# Altium project PCB_Project.PrjPcb
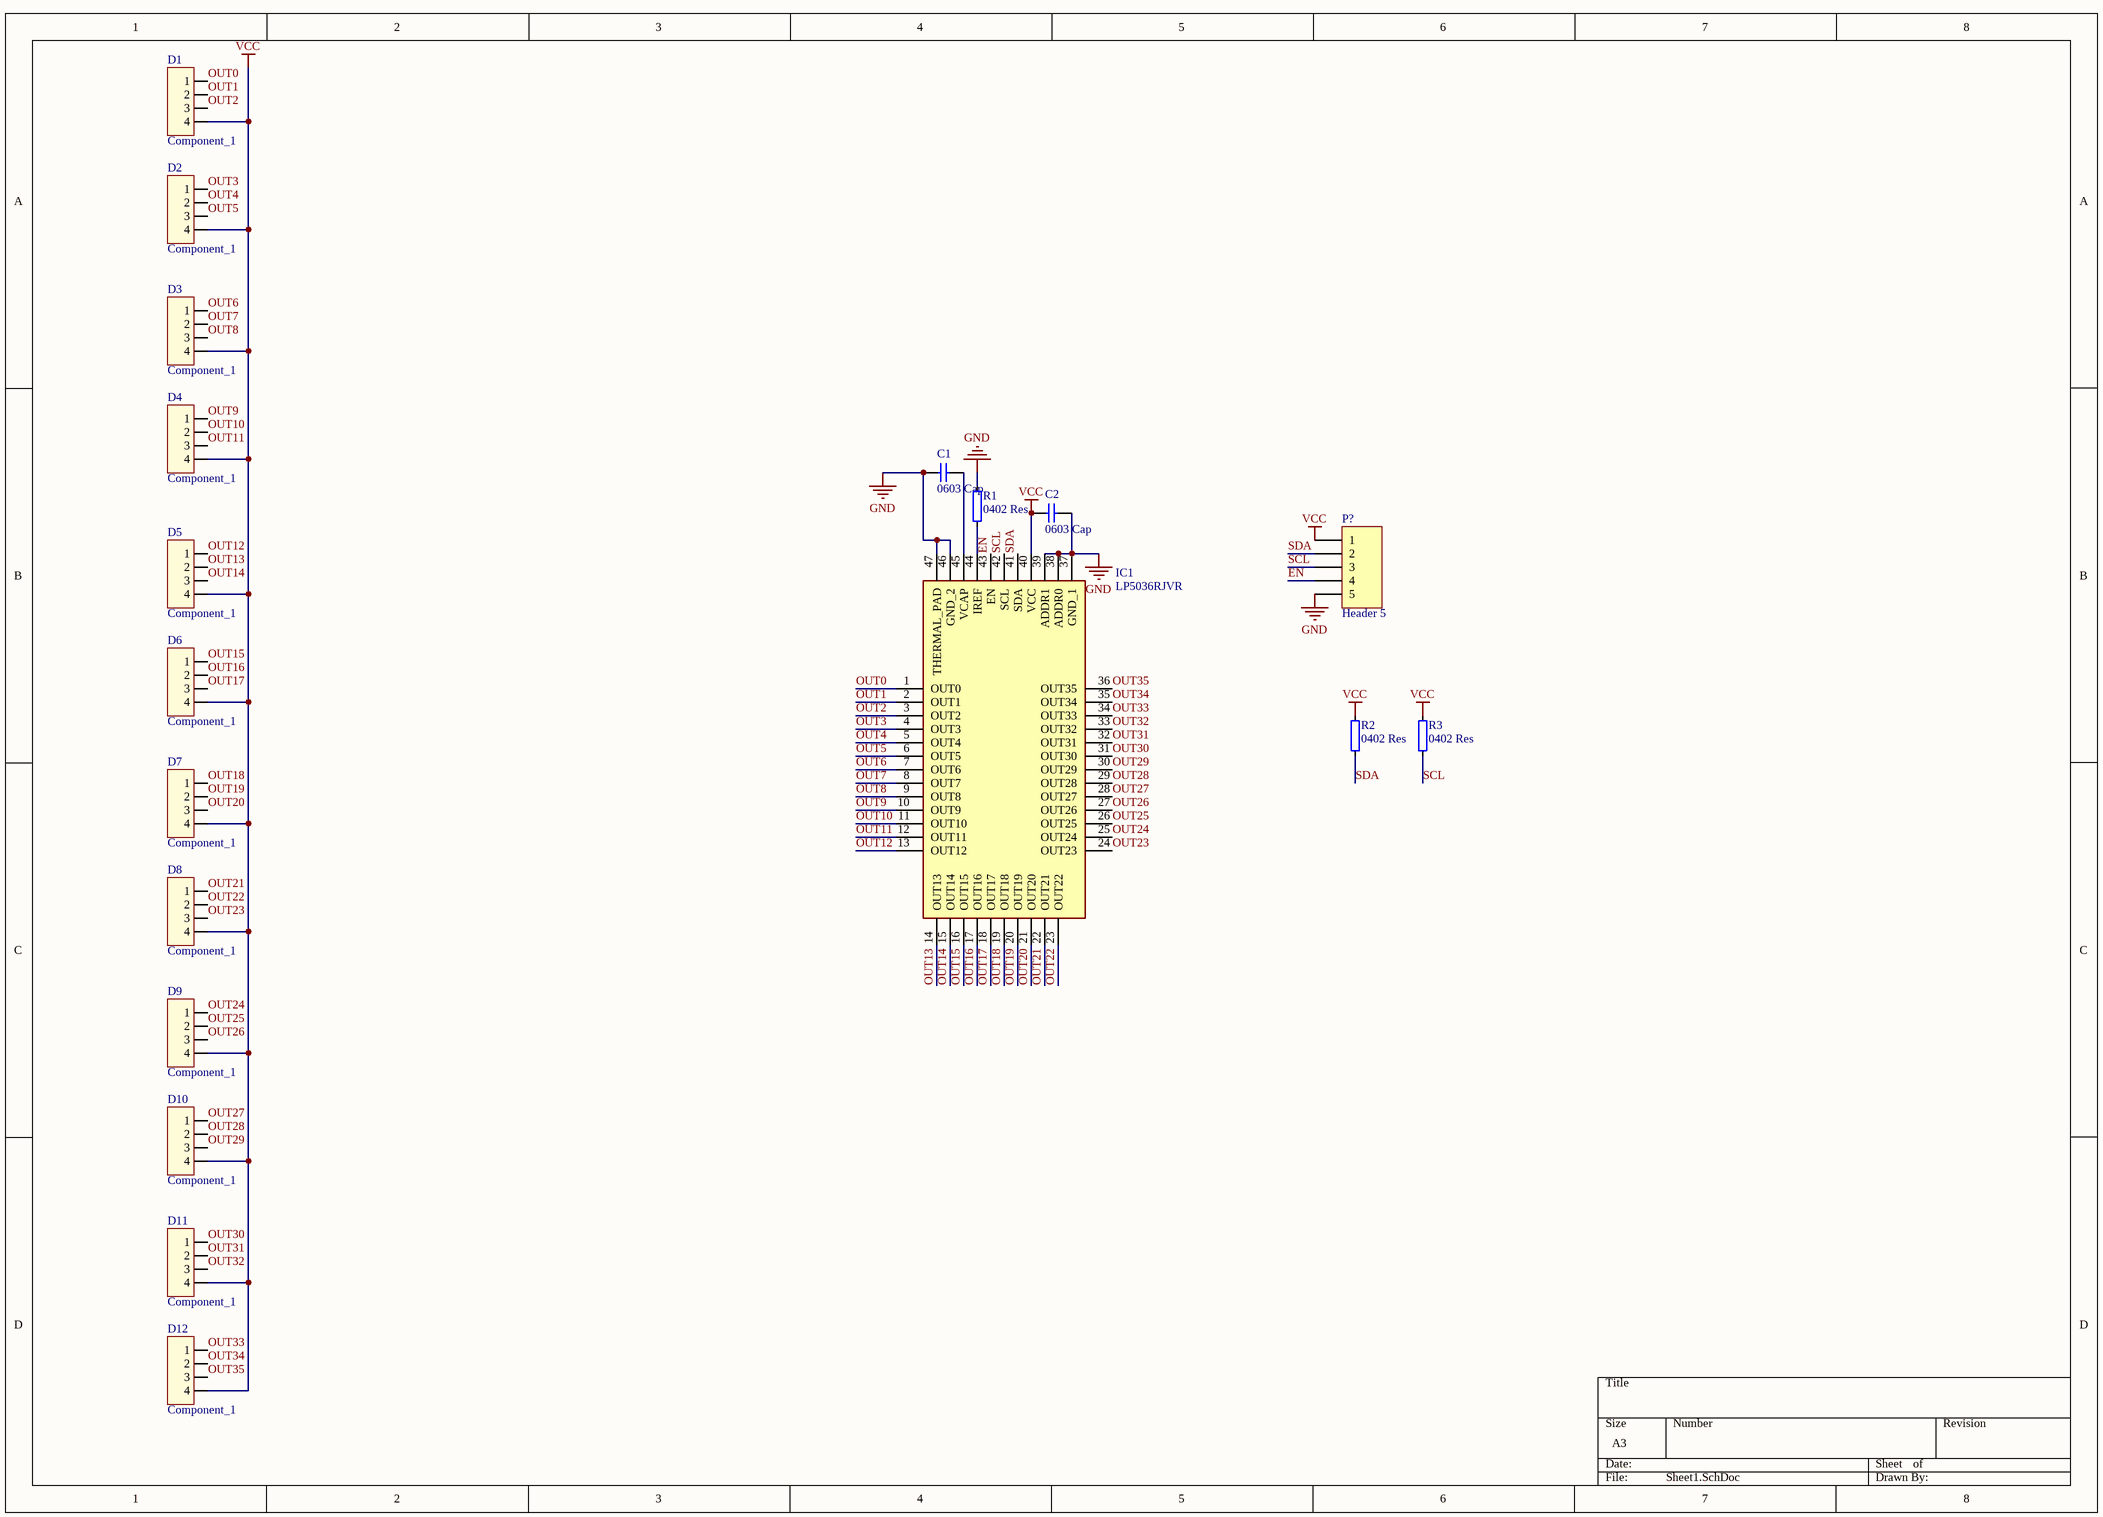
[diagram p0: Sheet1.SchDoc]
1 sheet, 19 parts. Net scope: global (net labels, ports and power ports of the same name join across sheets).
Board file: PCB2.PcbDoc

## Sheet Sheet1.SchDoc
size A3

### Parts
C1  0603 Cap  [0603 Cap]
C2  0603 Cap  [0603 Cap]
D1  Component_1  [PCBComponent_1]
D2  Component_1  [PCBComponent_1]
D3  Component_1  [PCBComponent_1]
D4  Component_1  [PCBComponent_1]
D5  Component_1  [PCBComponent_1]
D6  Component_1  [PCBComponent_1]
D7  Component_1  [PCBComponent_1]
D8  Component_1  [PCBComponent_1]
D9  Component_1  [PCBComponent_1]
D10  Component_1  [PCBComponent_1]
D11  Component_1  [PCBComponent_1]
D12  Component_1  [PCBComponent_1]
IC1  LP5036RJVR  [QFN40P500X600X100-47N-D]
P?  Header 5  [HDR1X5]
R1  0402 Res  [0402 Res]
R2  0402 Res  [0402 Res]
R3  0402 Res  [0402 Res]

### Nets
GND: C1.1 C2.2 IC1.37(GND_1) IC1.38(ADDR0) IC1.39(ADDR1) IC1.46(GND_2) IC1.47(THERMAL_PAD) P?.5 R1.2
VCC: C2.1 D1.4 D2.4 D3.4 D4.4 D5.4 D6.4 D7.4 D8.4 D9.4 D10.4 D11.4 D12.4 IC1.40(VCC) P?.1 R2.2 R3.2
EN: IC1.43(EN) P?.4
OUT0: D1.1 IC1.1(OUT0)
OUT1: D1.2 IC1.2(OUT1)
OUT2: D1.3 IC1.3(OUT2)
OUT3: D2.1 IC1.4(OUT3)
OUT4: D2.2 IC1.5(OUT4)
OUT5: D2.3 IC1.6(OUT5)
OUT6: D3.1 IC1.7(OUT6)
OUT7: D3.2 IC1.8(OUT7)
OUT8: D3.3 IC1.9(OUT8)
OUT9: D4.1 IC1.10(OUT9)
OUT10: D4.2 IC1.11(OUT10)
OUT11: D4.3 IC1.12(OUT11)
OUT12: D5.1 IC1.13(OUT12)
OUT13: D5.2 IC1.14(OUT13)
OUT14: D5.3 IC1.15(OUT14)
OUT15: D6.1 IC1.16(OUT15)
OUT16: D6.2 IC1.17(OUT16)
OUT17: D6.3 IC1.18(OUT17)
OUT18: D7.1 IC1.19(OUT18)
OUT19: D7.2 IC1.20(OUT19)
OUT20: D7.3 IC1.21(OUT20)
OUT21: D8.1 IC1.22(OUT21)
OUT22: D8.2 IC1.23(OUT22)
OUT23: D8.3 IC1.24(OUT23)
OUT24: D9.1 IC1.25(OUT24)
OUT25: D9.2 IC1.26(OUT25)
OUT26: D9.3 IC1.27(OUT26)
OUT27: D10.1 IC1.28(OUT27)
OUT28: D10.2 IC1.29(OUT28)
OUT29: D10.3 IC1.30(OUT29)
OUT30: D11.1 IC1.31(OUT30)
OUT31: D11.2 IC1.32(OUT31)
OUT32: D11.3 IC1.33(OUT32)
OUT33: D12.1 IC1.34(OUT33)
OUT34: D12.2 IC1.35(OUT34)
OUT35: D12.3 IC1.36(OUT35)
SCL: IC1.42(SCL) P?.3 R3.1
SDA: IC1.41(SDA) P?.2 R2.1
NetC1_2: C1.2 IC1.45(VCAP)
NetIC1_44: IC1.44(IREF) R1.1

### Library data of the parts
IC1 = LP5036RJVR: Integrated Circuit; Manufacturer_Name: Texas Instruments; Datasheet Link: http://www.ti.com/lit/ds/symlink/lp5030.pdf; Height: 1mm; Manufacturer_Part_Number: LP5036RJVR; Mouser Part Number: 595-LP5036RJVR; Mouser Price/Stock: https://www.mouser.com/Search/Refine.aspx?Keyword=595-LP5036RJVR
P? = Header 5: Header, 5-Pin; LatestRevisionDate: 17-Jul-2002; LatestRevisionNote: Re-released for DXP Platform.; Publisher: Altium Limited